# EAGLE schematic Ocreeb MK 2 _core _schematic (EAGLE 9.7.0)
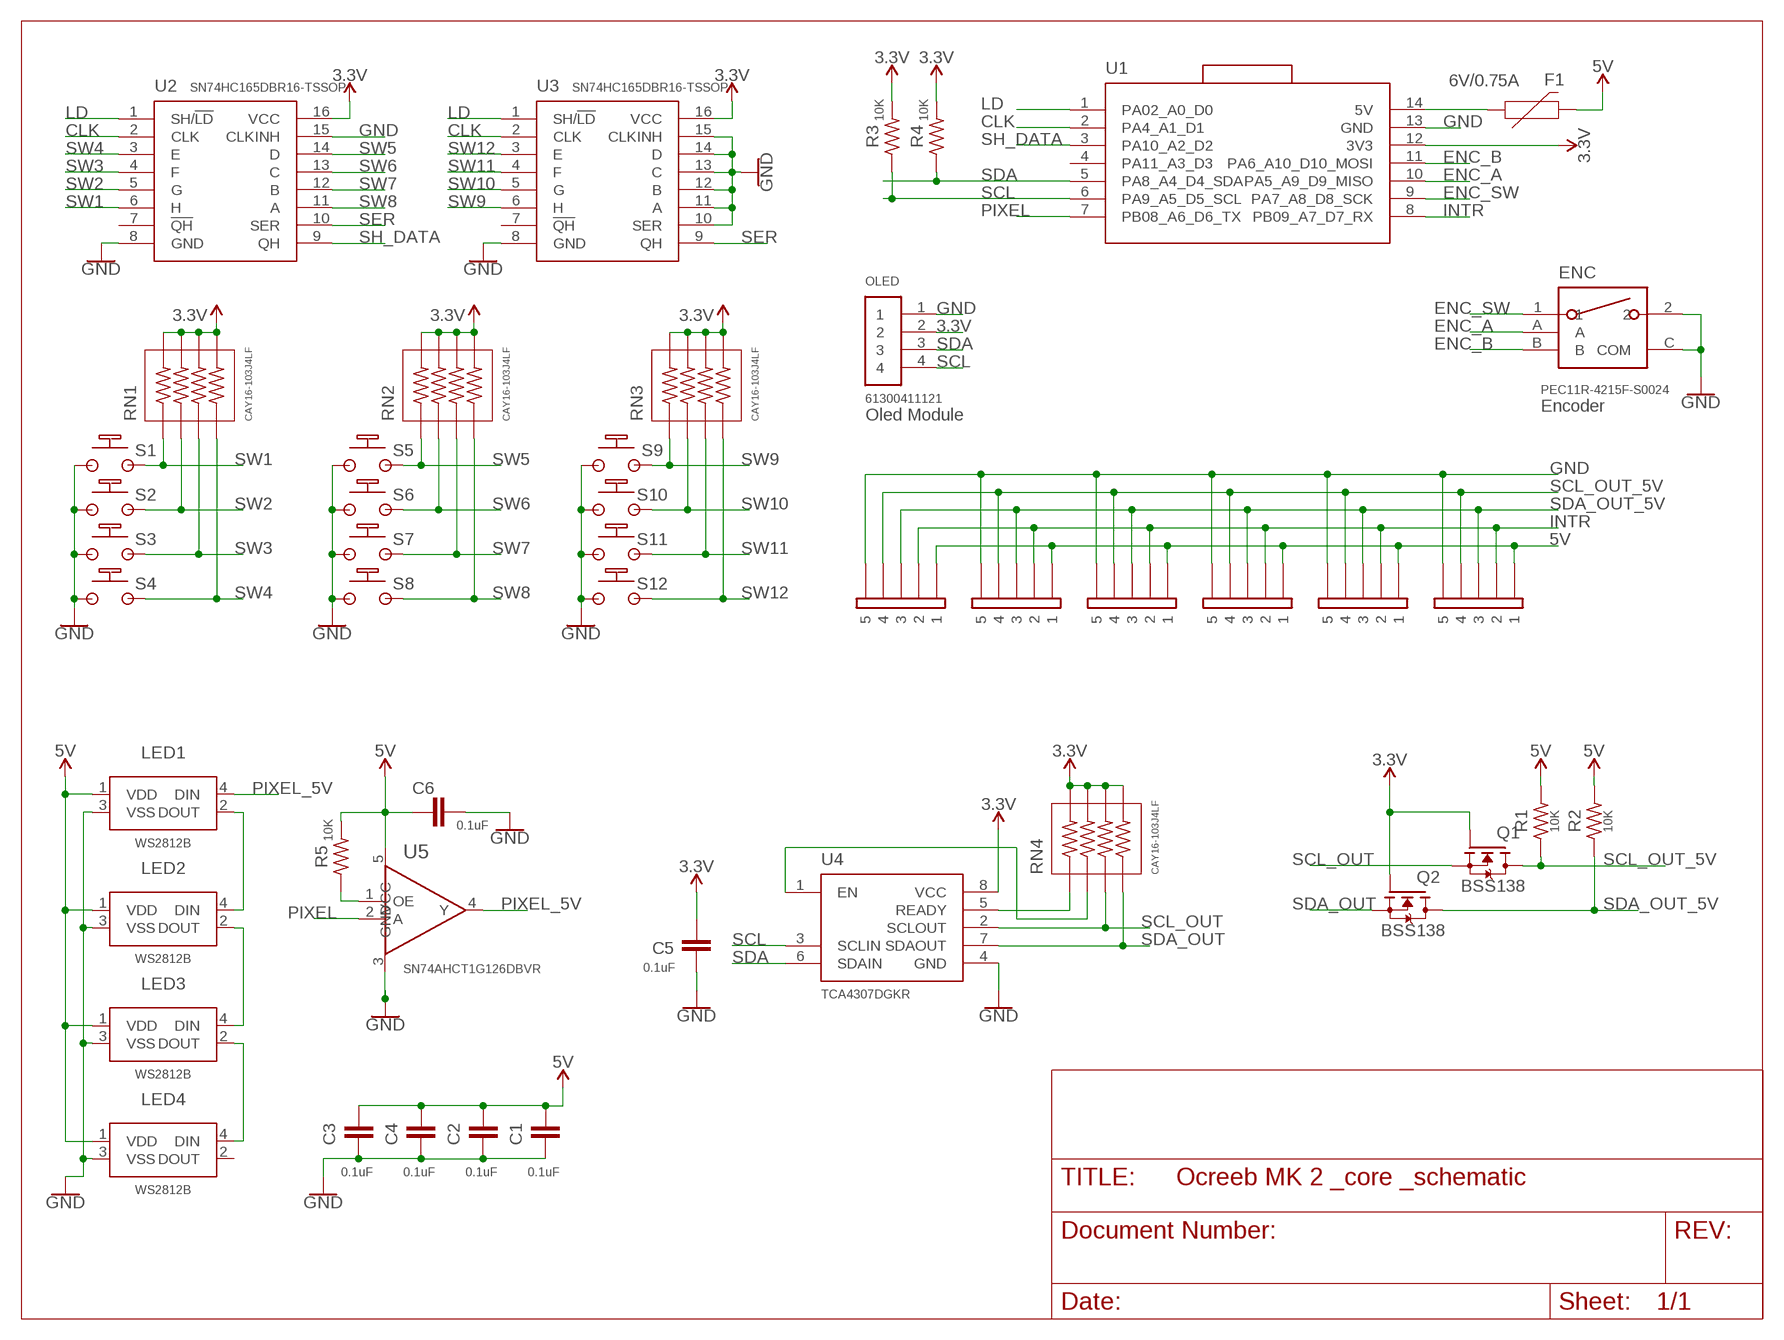
[diagram p0: schematic, sheet 1]

## Parts
C1  0.1uF  C_CHIP-0603(1608-METRIC)  [CAPC1608X85]
C2  0.1uF  C_CHIP-0603(1608-METRIC)  [CAPC1608X85]
C3  0.1uF  C_CHIP-0603(1608-METRIC)  [CAPC1608X85]
C4  0.1uF  C_CHIP-0603(1608-METRIC)  [CAPC1608X85]
C5  0.1uF  C_CHIP-0603(1608-METRIC)  [CAPC1608X85]
C6  0.1uF  C_CHIP-0603(1608-METRIC)  [CAPC1608X85]
ENC  PEC11R-4215F-S0024  [PEC11R-4215F-S0024]
F1  6V/0.75A  PPTC_0.75A  [1206]
LED1  WS2812B  [WS2812B]
LED2  WS2812B  [WS2812B]
LED3  WS2812B  [WS2812B]
LED4  WS2812B  [WS2812B]
OLED  61300411121  [61300411121]
Q1  BSS138  [SOT95P240X111-3N]
Q2  BSS138  [SOT95P240X111-3N]
R1  10K  R-US_CHIP-0603(1608-METRIC)  [RESC1608X60]
R2  10K  R-US_CHIP-0603(1608-METRIC)  [RESC1608X60]
R3  10K  R-US_CHIP-0603(1608-METRIC)  [RESC1608X60]
R4  10K  R-US_CHIP-0603(1608-METRIC)  [RESC1608X60]
R5  10K  R-US_CHIP-0603(1608-METRIC)  [RESC1608X60]
RN1  CAY16-103J4LF  [RESCAF80P320X160X60-8N]
RN2  CAY16-103J4LF  [RESCAF80P320X160X60-8N]
RN3  CAY16-103J4LF  [RESCAF80P320X160X60-8N]
RN4  CAY16-103J4LF  [RESCAF80P320X160X60-8N]
S1  MX1A-11NN  [CHERRY_MX1A-11NN_SWITCH]
S2  MX1A-11NN  [CHERRY_MX1A-11NN_SWITCH]
S3  MX1A-11NN  [CHERRY_MX1A-11NN_SWITCH]
S4  MX1A-11NN  [CHERRY_MX1A-11NN_SWITCH]
S5  MX1A-11NN  [CHERRY_MX1A-11NN_SWITCH]
S6  MX1A-11NN  [CHERRY_MX1A-11NN_SWITCH]
S7  MX1A-11NN  [CHERRY_MX1A-11NN_SWITCH]
S8  MX1A-11NN  [CHERRY_MX1A-11NN_SWITCH]
S9  MX1A-11NN  [CHERRY_MX1A-11NN_SWITCH]
S10  MX1A-11NN  [CHERRY_MX1A-11NN_SWITCH]
S11  MX1A-11NN  [CHERRY_MX1A-11NN_SWITCH]
S12  MX1A-11NN  [CHERRY_MX1A-11NN_SWITCH]
U1  MOUDLE-SEEEDUINO-XIAO-SMD  [MOUDLE14P-SMD-2.54-21X17.8MM]
U2  SN74HC165DBR16-TSSOP  [SOP65P640X120-16N]
U3  SN74HC165DBR16-TSSOP  [SOP65P640X120-16N]
U4  TCA4307DGKR  [SOP65P490X110-8N]
U5  SN74AHCT1G126DBVR  [SOT95P280X145-5N]
U$1  5PIN_EDGE  [5_POGO_EDGE]
U$2  5PIN_EDGE  [5_POGO_EDGE]
U$3  5PIN_EDGE  [5_POGO_EDGE]
U$4  5PIN_EDGE  [5_POGO_EDGE]
U$5  5PIN_EDGE  [5_POGO_EDGE]
U$6  5PIN_EDGE  [5_POGO_EDGE]

## Nets
3.3V [power]: C5.2 OLED.2 Q1.1(G) Q2.1(G) R3.2 R4.2 RN1.5 RN1.6 RN1.7 RN1.8 RN2.5 RN2.6 RN2.7 RN2.8 RN3.5 RN3.6 RN3.7 RN3.8 RN4.5 RN4.6 RN4.7 RN4.8 U1.12(3V3) U2.16(VCC) U3.16(VCC) U4.8(VCC)
5V [power]: C1.2 C2.2 C3.2 C4.2 C6.2 F1.2 LED1.1(VDD) LED2.1(VDD) LED3.1(VDD) LED4.1(VDD) R1.2 R2.2 R5.2 U5.5(VCC) U$1.1 U$2.1 U$3.1 U$4.1 U$5.1 U$6.1
CLK: U1.2(PA4_A1_D1) U2.2(CLK) U3.2(CLK)
ENC_A: ENC.A U1.10(PA5_A9_D9_MISO)
ENC_B: ENC.B U1.11(PA6_A10_D10_MOSI)
ENC_SW: ENC.1 U1.9(PA7_A8_D8_SCK)
GND [power]: C1.1 C2.1 C3.1 C4.1 C5.1 C6.1 ENC.2 ENC.C(COM) LED1.3(VSS) LED2.3(VSS) LED3.3(VSS) LED4.3(VSS) OLED.1 S1.1 S1.1_ALT S2.1 S2.1_ALT S3.1 S3.1_ALT S4.1 S4.1_ALT S5.1 S5.1_ALT S6.1 S6.1_ALT S7.1 S7.1_ALT S8.1 S8.1_ALT S9.1 S9.1_ALT S10.1 S10.1_ALT S11.1 S11.1_ALT S12.1 S12.1_ALT U1.13(GND) U2.8(GND) U2.15(CLKINH) U3.8(GND) U3.10(SER) U3.11(A) U3.12(B) U3.13(C) U3.14(D) U3.15(CLKINH) U4.4(GND) U5.3(GND) U$1.5 U$2.5 U$3.5 U$4.5 U$5.5 U$6.5
INTR: U1.8(PB09_A7_D7_RX) U$1.2 U$2.2 U$3.2 U$4.2 U$5.2 U$6.2
LD: U1.1(PA02_A0_D0) U2.1(SH/!LD) U3.1(SH/!LD)
N$1: RN4.1 U4.5(READY)
N$2: R5.1 U5.1(OE)
N$3: LED1.2(DOUT) LED2.4(DIN)
N$12: LED2.2(DOUT) LED3.4(DIN)
N$13: LED3.2(DOUT) LED4.4(DIN)
N$15: RN4.2 U4.1(EN)
PIXEL: U1.7(PB08_A6_D6_TX) U5.2(A)
PIXEL_5V: LED1.4(DIN) U5.4(Y)
SCL: OLED.4 R3.1 U1.6(PA9_A5_D5_SCL) U4.3(SCLIN)
SCL_OUT: Q1.2(S) RN4.3 U4.2(SCLOUT)
SCL_OUT_5V: Q1.3(D) R1.1 U$1.4 U$2.4 U$3.4 U$4.4 U$5.4 U$6.4
SDA: OLED.3 R4.1 U1.5(PA8_A4_D4_SDA) U4.6(SDAIN)
SDA_OUT: Q2.2(S) RN4.4 U4.7(SDAOUT)
SDA_OUT_5V: Q2.3(D) R2.1 U$1.3 U$2.3 U$3.3 U$4.3 U$5.3 U$6.3
SER: U2.10(SER) U3.9(QH)
SH_DATA: U1.3(PA10_A2_D2) U2.9(QH)
SW1: RN1.1 S1.2 S1.2_ALT U2.6(H)
SW2: RN1.2 S2.2 S2.2_ALT U2.5(G)
SW3: RN1.3 S3.2 S3.2_ALT U2.4(F)
SW4: RN1.4 S4.2 S4.2_ALT U2.3(E)
SW5: RN2.1 S5.2 S5.2_ALT U2.14(D)
SW6: RN2.2 S6.2 S6.2_ALT U2.13(C)
SW7: RN2.3 S7.2 S7.2_ALT U2.12(B)
SW8: RN2.4 S8.2 S8.2_ALT U2.11(A)
SW9: RN3.1 S9.2 S9.2_ALT U3.6(H)
SW10: RN3.2 S10.2 S10.2_ALT U3.5(G)
SW11: RN3.3 S11.2 S11.2_ALT U3.4(F)
SW12: RN3.4 S12.2 S12.2_ALT U3.3(E)
USB_5V [power]: F1.1 U1.14(5V)
Unconnected: LED4.2(DOUT) U1.4(PA11_A3_D3) U2.7(!QH) U3.7(!QH)

## Notes on the sheet
- Encoder
- Oled Module

## Library data of the parts
C1-C6 = Capacitor:C: Capacitor - Generic; CATEGORY: Capacitor
ENC = Switch:PEC11R-4215F-S0024: ROTARY ENCODER MECHANICAL 24PPR Manufacturer's datasheet <https://www.bourns.com/docs/Product-Datasheets/PEC11R.pdf>; CREATED_BY: PCBLayout.com; DIGIKEY_PART_NUMBER: PEC11R-4215F-S0024-ND; MANUFACTURER: Bourns Inc.; MPN: PEC11R-4215F-S0024
F1 = SparkFun-Fuses:PPTC: Resettable Fuse PPTC Resettable Fuse. Really a sort of resistor with a polymeric positive temperature coefficient whose resistance increases dramatically with an increase in temperature. When heated by the power passing through the resistance rises causing the current to be limited, protecting the circuit. This is achieved by the transition of the polymer from a crystalline to an amorphous state where the conductive carbon separates breaking the conductive pathways found in the cool crystalline structure. When a PPTC cools back down it resumes conducting letting the circuit turn back on. SparkFun Products: SparkFun RedBoard - Programmed with Arduino <https://www.sparkfun.com/products/12757> Pro Micro - 5V/16MHz <https://www.sparkfun.com/products/12640> Arduino Pro 328 - 5V/16MHz <https://www.sparkfun.com/products/10915> MP3 Trigger <https://www.sparkfun.com/products/13720>; PROD_ID: RES-11150
LED1-LED4 = WS2812B:WS2812B: Intelligent control LED integrated light source Datasheet <http://cdn.sparkfun.com/datasheets/BreakoutBoards/WS2812B.pdf>; CATEGORY: LED; COLOR: RGB; DESCRIPTION: LED integrated light source; MANUFACTURER: Worldsemi; MPN: WS2812B; OPERATING_TEMP: -25 ℃ to +80℃(TJ); PART_STATUS: Active; SUB_CATEGORY: RGB
OLED = Headers:61300411121: CONN HEADER VERT 4POS 2.54MM Manufacturer's datasheet <https://katalog.we-online.de/em/datasheet/6130xx11121.pdf>; CREATED_BY: PCBLayout.com; DIGI_KEY_PART_NUMBER: 732-5317-ND; MANUFACTURER: Wurth Electronics Inc.; MPN: 61300411121
Q1 Q2 = BSS138:BSS138: N-Channel 50V 220mA (Ta) 360mW (Ta) Surface Mount SOT-23-3 Check availability <https://pricing.snapeda.com/parts/BSS138/onsemi/view-part?ref=eda>; AVAILABILITY: In Stock; CHECK_PRICES: https://www.snapeda.com/parts/BSS138/Onsemi/view-part/?ref=eda; DESCRIPTION: N-Channel 50 V 220mA (Ta) 360mW (Ta) Surface Mount SOT-23-3; MF: onsemi; MP: BSS138; PACKAGE: None; PRICE: None; SNAPEDA_LINK: https://www.snapeda.com/parts/BSS138/Onsemi/view-part/?ref=snap
R1-R5 = Resistor:R-US: Resistor Fixed - ANSI; CATEGORY: Resistor; SUB-CATEGORY: Fixed
RN1-RN4 = CAY16-103J4LF:CAY16-103J4LF: Res Thick Film Array 75 Ohm 5% 0.25W(1/4W) ?200ppm/C ISOL Molded 8-Pin 1206(4 X 0603) Convex SMD T/R; CHECK_PRICES: https://www.snapeda.com/parts/CAY16-103J4LF/Bourns+-+J.W.+Miller/view-part/?ref=eda; DESCRIPTION: Resistor, Chip Array,10 Kilohms,62 mW,+ 5%,50 V (Max.) | Bourns CAY16-103J4LF; DIGIKEY_PART_NUMBER: CAY16-103J4LFTR-ND; MF: Bourns; MP: CAY16-103J4LF; PACKAGE: 1206 Bourns; PURCHASE-URL: https://www.snapeda.com/api/url_track_click_mouser/?unipart_id=47136&manufacturer=Bourns&part_name=CAY16-103J4LF&search_term=None; SNAPEDA_LINK: https://www.snapeda.com/parts/CAY16-103J4LF/Bourns+-+J.W.+Miller/view-part/?ref=snap
S1-S12 = MX Switch:MX1A-11NN: Cherry MX style switches with hot swap and soldered options; AVAILABILITY: In Stock; CHECK_PRICES: https://www.snapeda.com/parts/MX1A11NN/Cherry/view-part/?ref=eda; DESCRIPTION: SWITCH, TACTILE, SPST-NO, 10mA, THOUGH HOLE; Product Range:MX Series; Actuator Orientation:Top Actuated; Switch Mounting:Surface Mount; Actuator Style:Plunger for Cap; Actuating Force:59.5gf; Contact Rating:10mA at 12VDC RoHS Compliant: No; MF: Cherry; MP: MX1A11NN; PACKAGE: None; PRICE: None; SNAPEDA_LINK: https://www.snapeda.com/parts/MX1A11NN/Cherry/view-part/?ref=snap
U1 = XIAO RP2040:MOUDLE-SEEEDUINO-XIAO
U2 U3 = ul_SN74HC165DBR:SN74HC165DBR
U4 = TCA4307DGKR:TCA4307DGKR: Hot Swap Controller 1 Channel General Purpose 8-VSSOP Check availability <https://pricing.snapeda.com/parts/TCA4307DGKR/Texas%20Instruments/view-part?ref=eda>; AVAILABILITY: In Stock; CHECK_PRICES: https://www.snapeda.com/parts/TCA4307DGKR/Texas+Instruments/view-part/?ref=eda; DESCRIPTION: 2-bit bidirectional 2.3- to 5.5-V hot swappable 400-kHz I2C/SMBus buffer with Stuck Bus Recovery; MF: Texas Instruments; MP: TCA4307DGKR; PACKAGE: None; PRICE: None; PURCHASE-URL: https://pricing.snapeda.com/search?q=TCA4307DGKR&ref=eda; SNAPEDA_LINK: https://www.snapeda.com/parts/TCA4307DGKR/Texas+Instruments/view-part/?ref=snap
U5 = SN74AHCT1G126:SN74AHCT1G126DBVR; CHECK_PRICES: https://www.snapeda.com/parts/SN74AHCT1G126DBVR/Texas+Instruments/view-part/?ref=eda; DESCRIPTION: Single 4.5-V to 5.5-V buffer with TTL-compatible CMOS inputs and 3-state outputs; DIGIKEY_PART_NUMBER: 296-4710-2-ND; MF: Texas Instruments; MP: SN74AHCT1G126DBVR; PACKAGE: SOT-23-5 Texas Instruments; PURCHASE-URL: https://www.snapeda.com/api/url_track_click_mouser/?unipart_id=420895&manufacturer=Texas Instruments&part_name=SN74AHCT1G126DBVR&search_term=None; SNAPEDA_LINK: https://www.snapeda.com/parts/SN74AHCT1G126DBVR/Texas+Instruments/view-part/?ref=snap
U$1-U$6 = OCREEB_POGO_CON:5PIN_EDGE

## Net classes
0 default: width 0.203 mm, drill 0.381 mm, clearance 0.152 mm
1 power: width 0.457 mm, drill 0.381 mm, clearance 0.152 mm